# Altium schematic sheet I2C_Temperature_Sensors.SchDoc: PMIC-Area Temperature Sensors
size B; CheckedBy: Jason Sullins; Author: Jordan Harris-Toovy; Revision: 0.2; SheetNumber: 6; SheetTotal: 22; Size: ANSI B
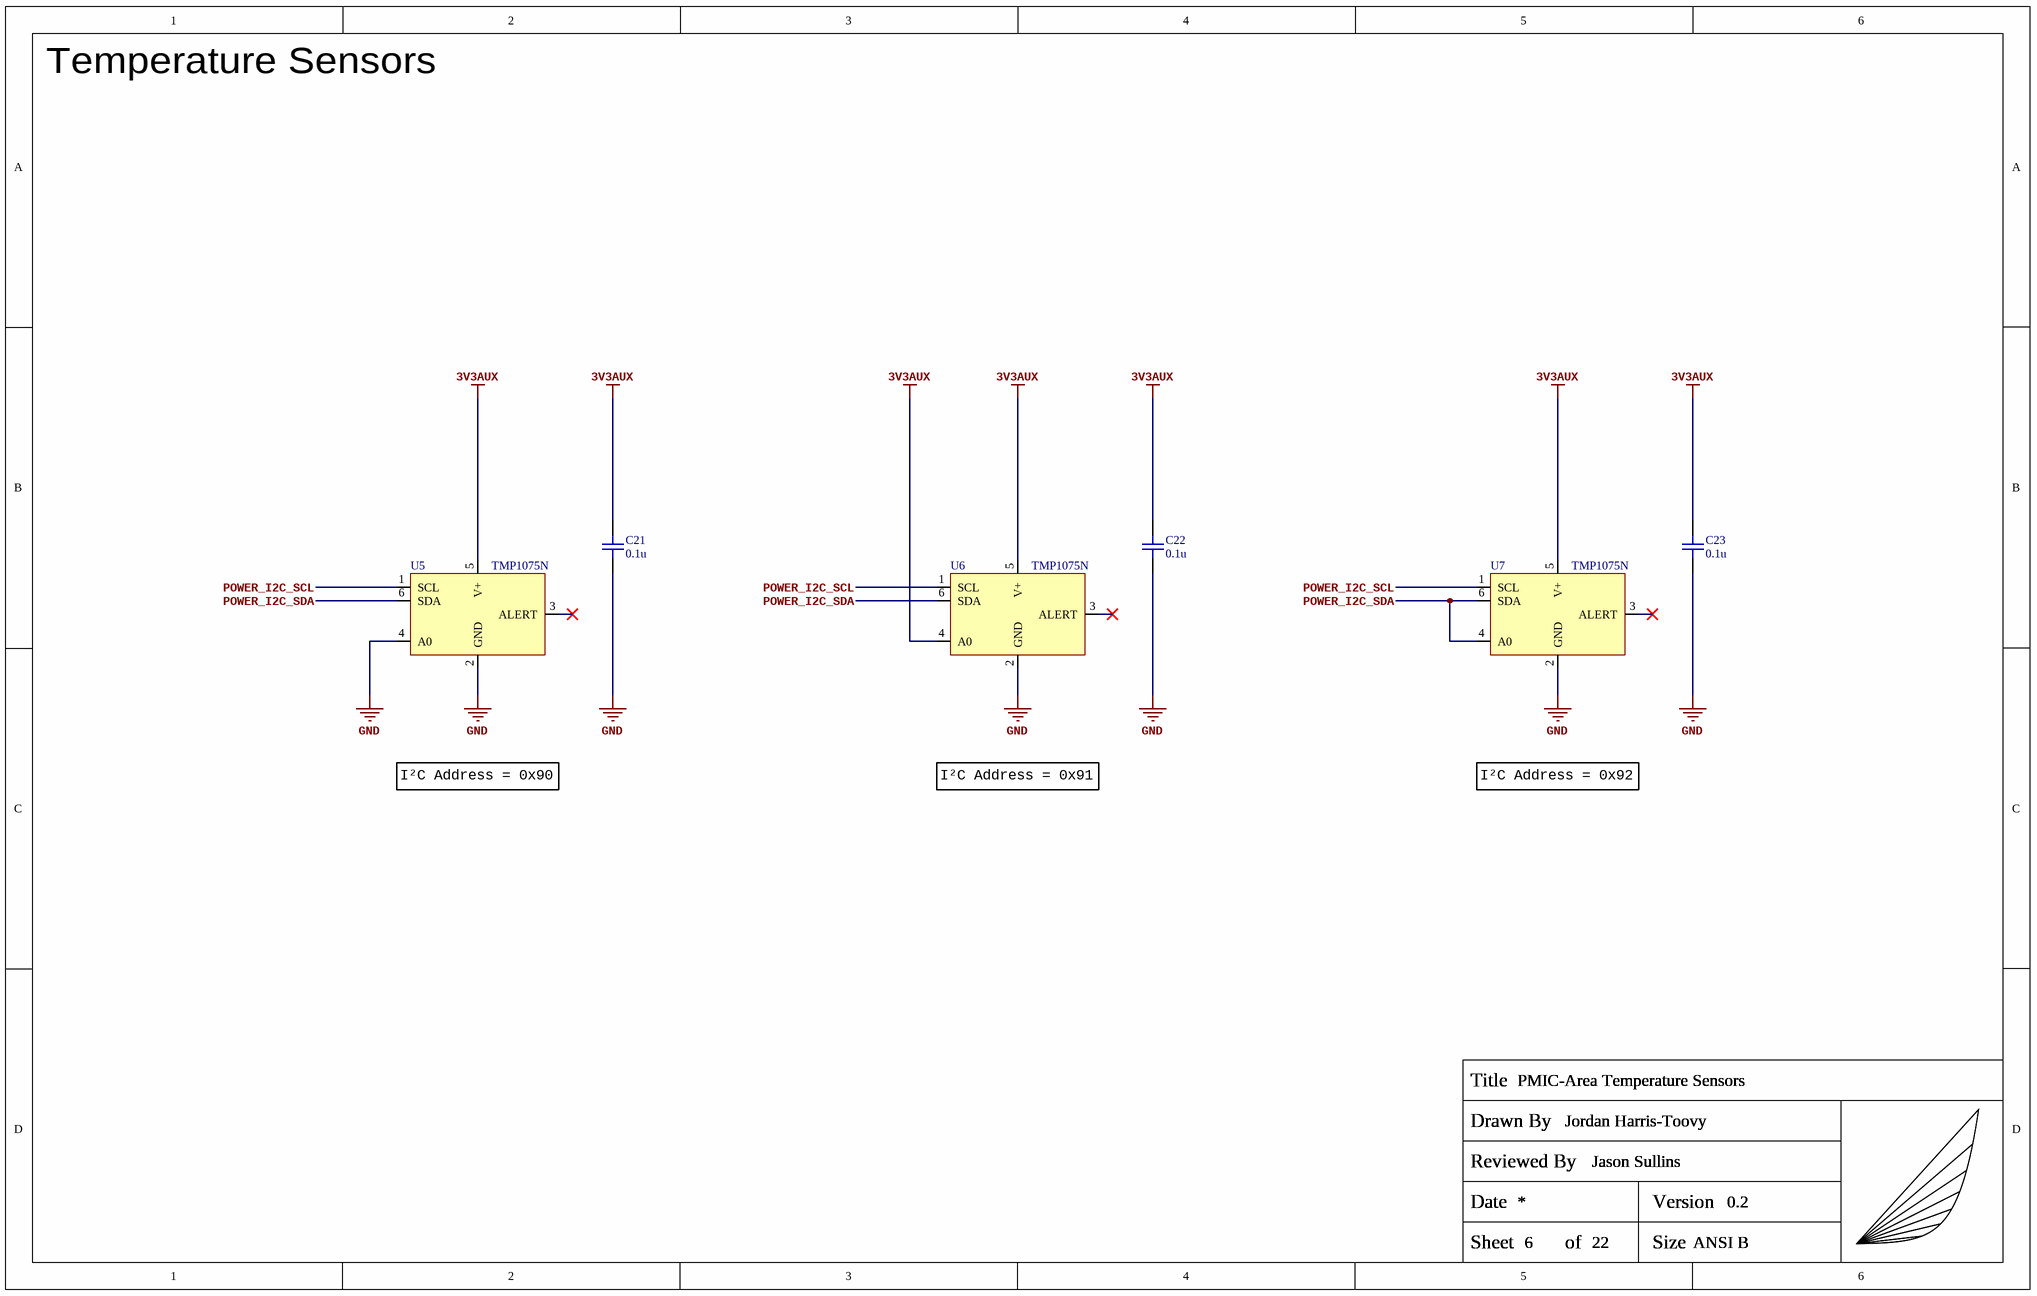
[diagram p0: I2C_Temperature_Sensors.SchDoc]

## Parts
C21  0.1u  [C_0402_Generic]
C22  0.1u  [C_0402_Generic]
C23  0.1u  [C_0402_Generic]
TITLEBLOCK?  Capstone_Title_Block  (value not drawn)  (graphical)
U5  TMP1075N  [TI_SOT-563]
U6  TMP1075N  [TI_SOT-563]
U7  TMP1075N  [TI_SOT-563]

## Nets
3V3AUX: C21.2 C22.2 C23.2 U5.5(V+) U6.4(A0) U6.5(V+) U7.5(V+)
GND: C21.1 C22.1 C23.1 U5.2(GND) U5.4(A0) U6.2(GND) U7.2(GND)
POWER_I2C_SCL: U5.1(SCL) U6.1(SCL) U7.1(SCL)
POWER_I2C_SDA: U5.6(SDA) U6.6(SDA) U7.4(A0) U7.6(SDA)

Not connected (* = marked no-connect by the designer): U5 3(ALERT)*; U6 3(ALERT)*; U7 3(ALERT)*

## Notes on the sheet
- Temperature Sensors
- I²C Address = 0x90
- I²C Address = 0x91
- I²C Address = 0x92
- (in symbol Capstone_Title_Block) Title; Drawn By; Reviewed By; Date; Version; Sheet; of; Size

## Library data of the parts
C21-C23 = GRM155R71C104KA88D: 0.1µF 16V X7R SMD ceramic capacitor in 0402 size; Manufacturer: Murata Electronics; Manufacturer Part Number: GRM155R71C104KA88D
TITLEBLOCK? = Capstone_Title_Block: Custom title block with personal logo; Manufacturer: NONE; Manufacturer Part Number: NONE
U5-U7 = TMP1075NDRLR: Temperature Sensor Digital, Local -40°C ~ 125°C 12 b SOT-563; Manufacturer: Texas Instruments; Manufacturer Part Number: TMP1075NDRLR